# EAGLE design 128x64_ada (EAGLE 9.3.0)
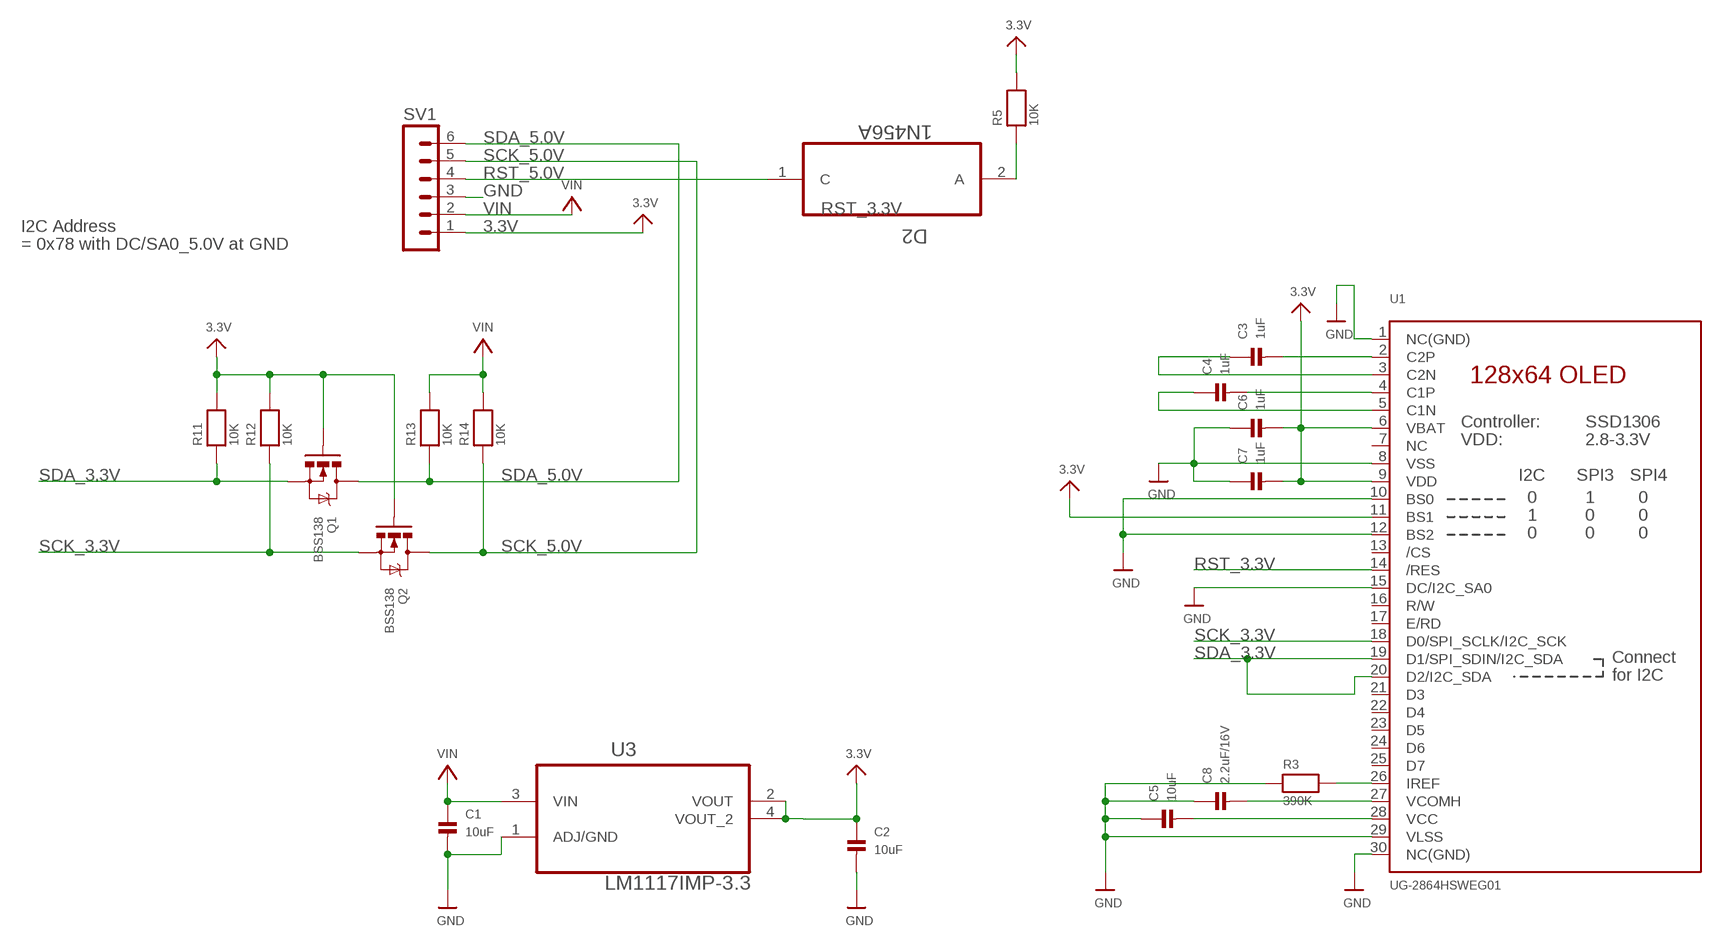
[diagram p0: schematic, sheet 1]

## Parts
C1  10uF  CAP_CERAMIC0805  [0805]
C2  10uF  CAP_CERAMIC0805  [0805]
C3  1uF  CAP_CERAMIC0805  [0805]
C4  1uF  CAP_CERAMIC0805  [0805]
C5  10uF  CAP_CERAMIC0805  [0805]
C6  1uF  CAP_CERAMIC0805  [0805]
C7  1uF  CAP_CERAMIC0805  [0805]
C8  2.2uF/16V  CAP_CERAMIC0805  [0805]
D2  1N456A  [DIO_1N456A]
Q1  BSS138  MOSFET-NCHANNEL2N7002PW  [SOT323]
Q2  BSS138  MOSFET-NCHANNEL2N7002PW  [SOT323]
R3  390K  RESISTOR0805  [0805]
R5  10K  RESISTOR0603  [0603]
R11  10K  RESISTOR0603  [0603]
R12  10K  RESISTOR0603  [0603]
R13  10K  RESISTOR0603  [0603]
R14  10K  RESISTOR0603  [0603]
SV1  MA06-1  [MA06-1]
U1  UG-2864HSWEG01  DISP_OLED_UG-2864HSWEG010.96"  [UG-2864HSWEG01_0.96IN_WRAPAROUND]
U3  LM1117IMP-3.3  [SOT230P696X180-4N]

## Nets
3.3V: C2.1 C6.2 C7.2 Q1.1(G) Q2.1(G) R5.2 R11.2 R12.2 SV1.1 U1.6(VBAT) U1.9(VDD) U1.11(BS1) U3.2(VOUT) U3.4(VOUT_2)
GND: C1.2 C2.2 C5.1 C6.1 C7.1 C8.1 R3.1 SV1.3 U1.1(NC(GND)) U1.8(VSS) U1.10(BS0) U1.12(BS2) U1.15(DC/I2C_SA0) U1.29(VLSS) U1.30(NC(GND)) U3.1(ADJ/GND)
N$3: R3.2 U1.26(IREF)
N$4: C3.2 U1.2(C2P)
N$5: C3.1 U1.3(C2N)
N$6: C4.2 U1.4(C1P)
N$7: C4.1 U1.5(C1N)
N$11: C5.2 U1.28(VCC)
N$12: C8.2 U1.27(VCOMH)
RST_3.3V: D2.2(A) R5.1 U1.14(/RES)
RST_5.0V: D2.1(C) SV1.4
SCK_3.3V: Q2.2(S) R12.1 U1.18(D0/SPI_SCLK/I2C_SCK)
SCK_5.0V: Q2.3(D) R14.1 SV1.5
SDA_3.3V: Q1.2(S) R11.1 U1.19(D1/SPI_SDIN/I2C_SDA) U1.20(D2/I2C_SDA)
SDA_5.0V: Q1.3(D) R13.1 SV1.6
VIN: C1.1 R13.2 R14.2 SV1.2 U3.3(VIN)
Unconnected: U1.7(NC) U1.13(/CS) U1.16(R/W) U1.17(E/RD) U1.21(D3) U1.22(D4) U1.23(D5) U1.24(D6) U1.25(D7)

## Notes on the sheet
- I2C Address
- = 0x78 with DC/SA0_5.0V at GND

## Library data of the parts
C1-C8 = microbuilder:CAP_CERAMIC: Ceramic Capacitors 0402 - 0402 Surface Mount Capacitors 16pF 50V 5% [Digikey: 445-4899-2-ND] 18pF 50V 5% [Digikey: 490-1281-2-ND] 22pF 50V 5% [Digikey: 490-1283-2-ND] 68pF 50V 5% [Digikey: 490-1289-2-ND] 0.1uF 10V 10% [Digikey: 490-1318-2-ND] 1.0uF 6.3V 10% [Digikey: 490-1320-2-ND] 0603 - 0603 Surface Mount Capacitors 16 pF 50V 5% [Digikey: 445-5051-2-ND] 22 pF 50V [Digikey: PCC220ACVTR-ND] 33 pF 50V 5% [Digikey: 490-1415-1-ND] 56pF 50V 5% [Digikey: 490-1421-1-ND] 220pF 50V 5% [Digikey: 445-1285-1-ND] 680 pF 50V 2200 pF 50V 5% C0G [Digikey: 445-1297-1-ND] 5600 pF 100V 5% X7R [Digikey: 478-3711-1-ND] 0.1 µF 25V 10% [Digikey: PCC2277TR-ND] 0.22 µF 16V 10% X7R [Digikey: 445-1318-1-ND] 1.0 µF 25V 10% [Digikey: 445-5146-2-ND] 0603 - RF Specific 3pF 250V +/-0.1pF RF [Digikey: 712-1347-1-ND] 18 pF 250V 5% [Digikey: 478-3505-1-ND or 712-1322-1-ND] 56 pF 250V 5% C0G RF [Digikey: 490-4867-1-ND] 68 pF 250V RF [Digikey: 490-4868-1-ND] 0805 - 0805 Surface Mount Capacitors 220 pF 250V 2% RF Ceramic Capacitor [Digikey: 712-1398-1-ND] 1000 pF 50V 2% NP0 Ceramic Capacitor [Digikey: 478-3760-1-ND] 0.1 µF 25V 10% Ceramic Capacitor [Digikey: PCC1828TR-ND] 1.0 µF 16V 10% Ceramic Capacitor[Digikey: 490-1691-2-ND] 10.0 µF 10V 10% Ceramic Capacitor[Digikey: 709-1228-1-ND] 10.0 uF 16V 10% Ceramic Capacitor [Digikey: 478-5165-2-ND] 47 uF 6.3V 20% Ceramic Capacitor [Digikey: 587-1779-1-ND or 399-5506-1-ND] 1206 - 1206 Surface Mount Capacitors 47uF 10V 20% Ceramic Capacitor [Digikey: 490-5528-1-ND or 399-5508-1-ND or 445-6010-1-ND] 100uF 6.3V -20%, +80% Y5V Ceramic Capacitor (Digikey: 490-4512-1-ND, Mouser: 81-GRM31CF50J107ZE1L)
D2 = Fairchild_By_element14_Batch_1:1N456A: Small Signal Diode; MPN: 1N456A; OC_FARNELL: 1467557; OC_NEWARK: 38C7675; PACKAGE: DO-35; SUPPLIER: Fairchild Semiconductor
Q1 Q2 = BeagleBone_Blue_R3:MOSFET-NCHANNEL: Common NMOSFET Parts MFG P/N Store ID Prod ID FDD8780 TRANS-09984 SI7820DN TRANS-11055 FDS6630A IC-08089 2N7002PW TRANS-11151 FQP30N06L COM-10213 TRANS-10060 BSS123LT1G TRANS-08345 BSS138 TRANS-00830 BS170 2N7000; PROD_ID: TRANS-11151
R3 R5 R11-R14 = microbuilder:RESISTOR: Resistors 0402 - 0402 Surface Mount Package 22 Ohm 1% 1/16W [Digikey: 311-22.0LRTR-ND] 33 Ohm 5% 1/16W 1.0K 5% 1/16W 1.5K 5% 1/16W 2.0K 1% 1/16W 10.0K 1% 1/16W [Digikey: 311-10.0KLRTR-ND] 10.0K 5% 1/16W [Digikey: RMCF0402JT10K0TR-ND] 12.1K 1% 1/16W [Digikey: 311-22.0LRTR-ND] 100.0K 5% 1/16W 0603 - 0603 Surface Mount Package 0 Ohm 1/10 Watt 1% Resistor 15 Ohm 1/10 Watt 1% Resistor 33 Ohm 1/10 Watt 1% Resistor 49.9 Ohm 1/10 Watt 1% Resistor 100 Ohm 1/10 Watt 1% Resistor 150 Ohm 1/10 Watt 1% Resistor 240 Ohm 1/10 Watt 1% Resistor 390 Ohm 1/10 Watt 1% Resistor 560 Ohm 1/10 Watt 1% Resistor 680 Ohm 1/10 Watt 1% Resistor 750 Ohm 1/10 Watt 1% Resistor 1.0K Ohm 1/10 Watt 1% Resistor 1.5K Ohm 1/10 Watt 1% Resistor 2.0K Ohm 1/10 Watt 1% Resistor 2.2K Ohm 1/10 Watt 1% Resistor 3.3K Ohm 1/10 Watt 1% Resistor 4.7K Ohm 1/10 Watt 1% Resistor 10.0K Ohm 1/10 Watt 1% Resistor 12.0K Ohm 1/10 Watt 1% Resistor 12.1K Ohm 1/10 Watt 1% Resistor 20.0K Ohm 1/10 Watt 1% Resistor 33.0K Ohm 1/10 Watt 1% Resistor 100.0K Ohm 1/10 Watt 1% Resistor 0805 - 0805 Surface Mount Package 0 Ohm 1/8 Watt 1% Resistor 33 Ohm 1/8 Watt 1% Resistor 100 Ohm 1/8 Watt 1% Resistor 150 Ohm 1/8 Watt 1% Resistor 200 Ohm 1/8 Watt 1% Resistor 240 Ohm 1/8 Watt 1% Resistor 330 Ohm 1/8 Watt 1% Resistor 390 Ohm 1/8 Watt 1% Resistor 470 Ohm 1/8 Watt 1% Resistor 1.0K Ohm 1/8 Watt 1% Resistor 1.5K Ohm 1/8 Watt 1% Resistor 2.0K Ohm 1/8 Watt 1% Resistor 4.7K Ohm 1/8 Watt 1% Resistor 5.1K Ohm 1/8 Watt 1% Resistor 5.6K Ohm 1/8 Watt 1% Resistor 10.0K Ohm 1/8 Watt 1% Resistor 22.0K Ohm 1/8 Watt 1% Resistor 33.0K Ohm 1/8 Watt 1% Resistor 100K Ohm 1/8 Watt 1% Resistor 1206 - 1206 Surface Mount Package 2012 - 2010 Surface Mount Package 0.11 Ohm 1/2 Watt 1% Resistor - Digikey: RHM.11UCT-ND
SV1 = con-lstb:MA06-1: PIN HEADER; OC_FARNELL: unknown; OC_NEWARK: unknown
U1 = microbuilder:DISP_OLED_UG-2864HSWEG01: UG-2864HSWEG01 OLED display Both 1.3" and 0.96" models share the same FPC tab footprint, only the screen dimensions vary.
U3 = NSC_By_element14_Batch_1.1:LM1117IMP-3.3: IC REG LDO 800MA 3.3V; MPN: LM1117IMP-3.3; OC_FARNELL: 1469051; OC_NEWARK: 41K3450; PACKAGE: SOT-223; SUPPLIER: National Semiconductor

## Board
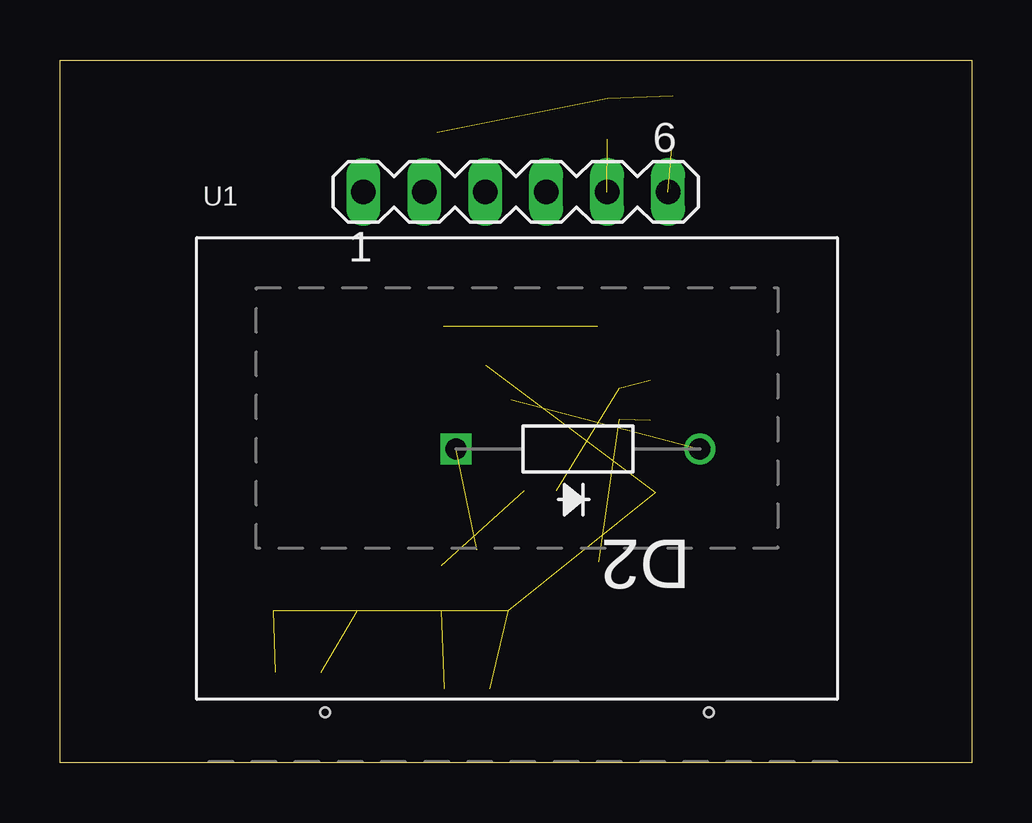
[diagram p1: board, top side]
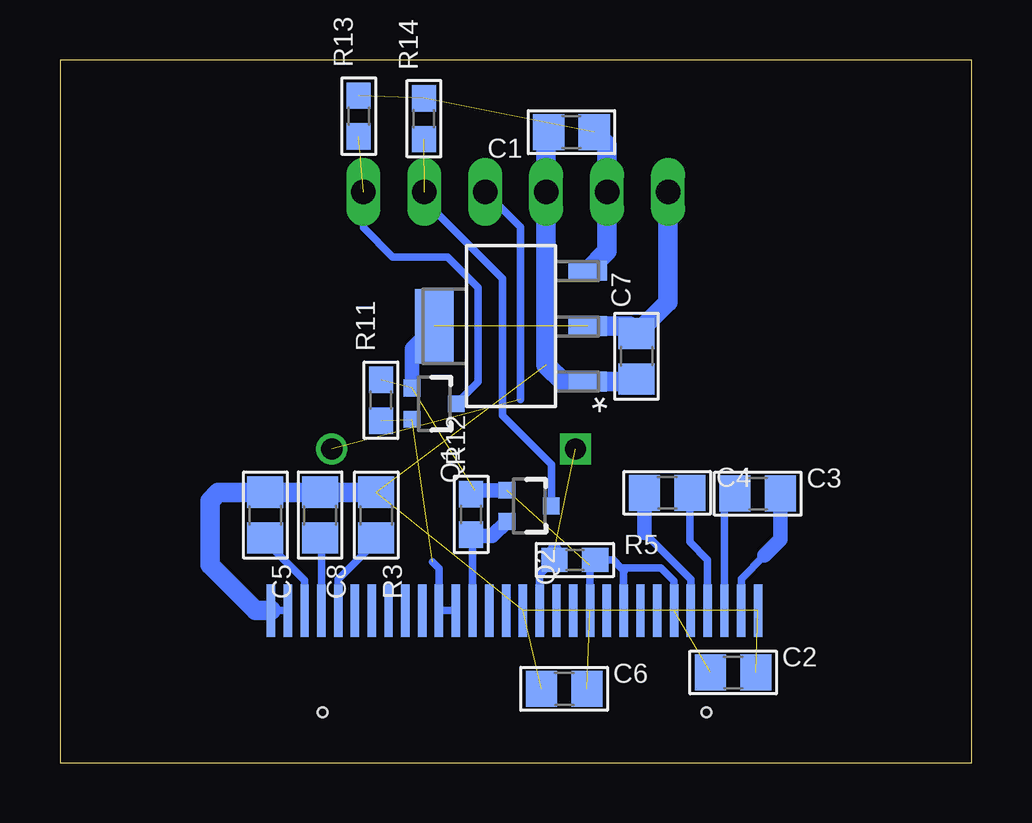
[diagram p2: board, bottom side, seen from below]

Size 38 x 29.3 mm. Coordinates in mm from the lower left corner, seen from the top.
Outline: 0,0 0,29.3 38,29.3 38,0 0,0
Copper layers (1*16): Top 0.035mm / dielectric 1.5mm / Bottom 0.035mm
Design rules "default": minimum track width 8mil, minimum drill 0.4mm, track to track 8mil, track to pad 8mil, pad to pad 8mil, via to via 8mil, smd to smd 8mil, copper to edge 20mil, drill to drill 8mil, minimum pad ring 8mil, minimum via ring 10mil, stop-mask expansion 3mil, vias tented up to drill 20mil, thermal gap 8mil

### Footprints (pad centres in the part's own frame; a part is rotated, then mirrored left to right if it is on the bottom)
0805 = smd 1.3 x 1.5: 1 -0.95,0; 2 0.95,0
DIO_1N456A = drill 0.889: 1 -10.16,0 | drill 0.889 square: 2 0,0
SOT323 = smd 0.7 x 0.7: 1 -0.65,-0.925; 2 0.65,-0.925; 3 0,0.925
0603 = smd 1.1 x 1: 1 -0.85,0; 2 0.85,0
MA06-1 = drill 1.016 long: 1 -6.35,0; 2 -3.81,0; 3 -1.27,0; 4 1.27,0; 5 3.81,0; 6 6.35,0
UG-2864HSWEG01_0.96IN_WRAPAROUND = smd 0.35 x 2.2 bottom: 1 -10.15,-1.2; 2 -9.45,-1.2; 3 -8.75,-1.2; 4 -8.05,-1.2; 5 -7.35,-1.2; 6 -6.65,-1.2; 7 -5.95,-1.2; 8 -5.25,-1.2; 9 -4.55,-1.2; 10 -3.85,-1.2; 11 -3.15,-1.2; 12 -2.45,-1.2; 13 -1.75,-1.2; 14 -1.05,-1.2; 15 -0.35,-1.2; 16 0.35,-1.2; 17 1.05,-1.2; 18 1.75,-1.2; 19 2.45,-1.2; 20 3.15,-1.2; 21 3.85,-1.2; 22 4.55,-1.2; 23 5.25,-1.2; 24 5.95,-1.2; 25 6.65,-1.2; 26 7.35,-1.2; 27 8.05,-1.2; 28 8.75,-1.2; 29 9.45,-1.2; 30 10.15,-1.2 | hole 0.4: -8,-5.45; 8,-5.45
SOT230P696X180-4N = smd 1.6 x 0.838: 1 -3.2,2.311; 2 -3.2,0; 3 -3.2,-2.311 | smd 1.6 x 3.099: 4 3.2,0

### Placement (x,y rotation side)
C1  16.68,26.29 180 bottom
C2  9.94,3.76 0 bottom
C3  8.91,11.22 0 bottom
C4  12.69,11.25 0 bottom
C5  29.44,10.33 270 bottom
C6  16.98,3.08 0 bottom
C7  13.96,16.95 90 bottom
C8  27.15,10.33 270 bottom
D2  16.51,13.08 180 top
Q1  22.4,14.97 270 bottom
Q2  18.44,10.71 270 bottom
R3  24.81,10.33 270 bottom
R5  16.54,8.45 0 bottom
R11  24.62,15.12 90 bottom
R12  20.86,10.35 90 bottom
R13  25.54,26.96 90 bottom
R14  22.83,26.85 90 bottom
SV1  19,23.8 0 top
U1  19.05,7.54 0 top
U3  19.2,18.2 180 bottom

### Tracks (layer width: path | path; a pad name or v marks a point on that pad's centre or on a via)
3.3V  (6 unrouted)
  Bottom 0.305: 14.61,8.13 14.93,8.45 R5.2 15.9,8.24 U1.11 | 14.61,8.13 14.48,8 14.5,7.98 U1.9 | U1.6 12.4,7.58 12.95,8.13 14.61,8.13
  Bottom 0.61: Q1.1 23.33,17.27 U3.4 | Q2.1 20.7,11.36 R12.2
  Bottom 0.813: U3.2 14.27,18.2 C7.2 12.65,19.21 SV1.1
GND  (8 unrouted)
  Bottom 0.305: U1.30 U1.29
  Bottom 0.813: C1.2 17.73,26.19 SV1.3 17.73,16.59 17.02,15.88 17,15.89 U3.1 14.07,15.89 C7.1 | R3.1 C8.1 C5.1 31.4,11.28 31.75,10.92 31.75,8.26 29.84,6.34 U1.30
N$3
  Bottom 0.305: U1.26 26.4,7.63 24.81,9.22 R3.2
N$4
  Bottom 0.305: U1.2 9.6,7.67 8.64,8.64
  Bottom 0.61: 8.64,8.64 7.96,9.31 C3.2
N$5
  Bottom 0.305: U1.3 10.3,10.78 C3.1
N$6
  Bottom 0.305: U1.4 11,8.46 11.74,9.2 C4.2
N$7
  Bottom 0.305: U1.5 11.7,7.64 13.64,9.57
  Bottom 0.61: 13.64,9.57 C4.1
N$11
  Bottom 0.305: U1.28 27.8,7.61 29.44,9.25 C5.2
N$12
  Bottom 0.305: U1.27 27.1,9.32 C8.2
RST_3.3V  (1 unrouted)
  Bottom 0.305: U1.14 18,7.84 R5.1
  Bottom 0.61: R5.1 17.39,8.87
RST_5.0V  (1 unrouted)
  Bottom 0.305: SV1.4 18.8,22.33 18.8,15.14
SCK_3.3V
  Bottom 0.305: U1.18 20.8,9.45 R12.1
  Bottom 0.61: Q2.2 19.98,9.45 20.8,9.45
SCK_5.0V  (1 unrouted)
  Bottom 0.305: Q2.3 17.52,12.44 19.56,14.48 19.56,20.19 22.81,23.45 SV1.5
SDA_3.3V  (2 unrouted)
  Bottom 0.305: U1.19 U1.20 22.2,8.11 22.48,8.38
SDA_5.0V  (1 unrouted)
  Bottom 0.305: SV1.6 25.35,22.3 24.13,21.08 21.84,21.08 20.57,19.81 20.57,15.87 Q1.3
VIN  (2 unrouted)
  Bottom 0.813: C1.1 15.19,25.75 SV1.2 15.19,21.32 U3.3